# EAGLE design Joystick board (EAGLE 9.6.2)
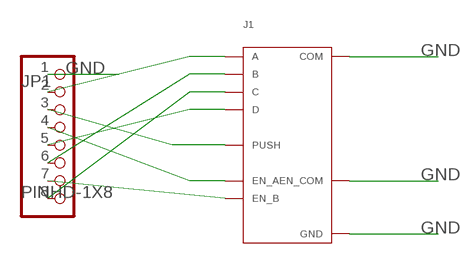
[diagram p0: schematic, sheet 1]

## Parts
J1  RKJXT1F42001  [RKJXT1F42001]
JP1  PINHD-1X8  [1X08]

## Nets
GND: J1.COM J1.ENCODER_COM(EN_COM) J1.GND JP1.1
N$1: J1.A JP1.2
N$2: J1.B JP1.6
N$3: J1.C JP1.8
N$4: J1.D JP1.5
N$5: J1.PUSH JP1.3
N$6: J1.ENCODER_A(EN_A) JP1.4
N$7: J1.ENCODER_B(EN_B) JP1.7

## Library data of the parts
J1 = PP_Electromechanical:RKJXT1F42001
JP1 = Connector:PINHD-1X8: PIN HEADER; CATEGORY: CONNECTOR; SUB-CATEGORY: PIN-HEADER

## Board
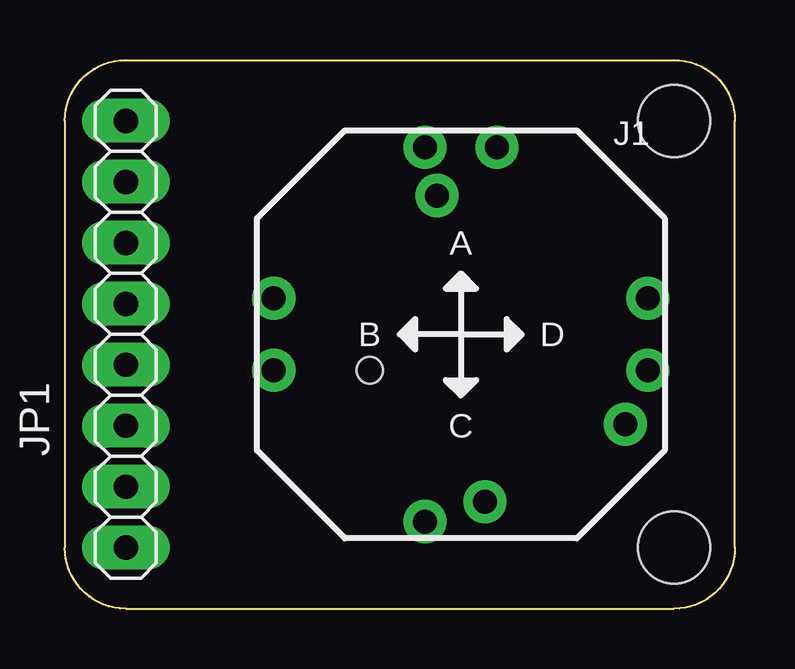
[diagram p1: board, top side]
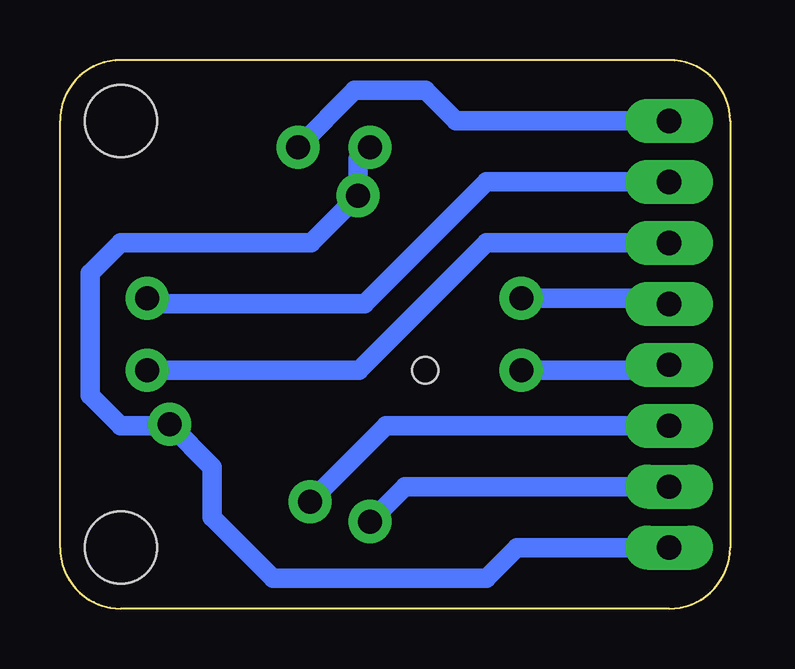
[diagram p2: board, bottom side, seen from below]

Size 27.94 x 22.86 mm. Coordinates in mm from the lower left corner, seen from the top.
Outline: 2.54,0 25.4,0 arc90 27.94,2.54 27.94,20.32 arc90 25.4,22.86 2.54,22.86 arc90 0,20.32 0,2.54 arc90 2.54,0
Copper layers (1*16): Top 0.035mm / dielectric 1.5mm / Bottom 0.035mm
Design rules "swidzi_milling_3018_tht_test": minimum track width 20mil, minimum drill 0.8mm, track to track 20mil, track to pad 20mil, pad to pad 24mil, via to via 6mil, smd to smd 6mil, copper to edge 15mil, drill to drill 6mil, minimum pad ring 10mil, minimum via ring 8mil, stop-mask expansion 4mil, vias tented up to drill 0mil, thermal gap 10mil
Holes 3 mm at 25.4,2.54 25.4,20.32

### Footprints (pad centres in the part's own frame; a part is rotated, then mirrored left to right if it is on the bottom)
RKJXT1F42001 = drill 1 pad 1.676: A -1.5,-7.8; B 7.8,-1.5; C 1.5,7.8; COM -1,5.78; D -7.8,1.5; ENCODER_A -7.8,-1.5; ENCODER_B 7.8,1.5; ENCODER_COM -1.5,7.8; GND 6.86,-3.75; PUSH 1,-6.98 | hole 1.1: -3.8,-1.5
1X08 = drill 1.016 long: 1 -8.89,0; 2 -6.35,0; 3 -3.81,0; 4 -1.27,0; 5 1.27,0; 6 3.81,0; 7 6.35,0; 8 8.89,0

### Placement (x,y rotation side)
J1  16.51,11.43 0 top
JP1  2.54,11.43 90 top

### Tracks (layer width: path | path; a pad name or v marks a point on that pad's centre or on a via)
GND
  Bottom 0.813: J1.ENCODER_COM 15.51,18.73 J1.COM 17.48,15.24 25.4,15.24 26.67,13.97 26.67,8.89 25.4,7.62 23.43,7.62 J1.GND 21.59,5.9 21.59,3.81 19.05,1.27 10.16,1.27 8.89,2.54 JP1.1
N$1
  Bottom 0.813: J1.A 13.56,5.08 JP1.2
N$2
  Bottom 0.813: J1.B 15.47,9.93 10.16,15.24 JP1.6
N$3
  Bottom 0.813: J1.C 15.65,21.59 12.7,21.59 11.43,20.32 JP1.8
N$4
  Bottom 0.813: J1.D 2.77,12.93 JP1.5
N$5
  Bottom 0.813: J1.PUSH 14.34,7.62 JP1.3
N$6
  Bottom 0.813: J1.ENCODER_A 2.77,9.93 JP1.4
N$7
  Bottom 0.813: J1.ENCODER_B 24.08,12.7 15.24,12.7 10.16,17.78 JP1.7